# Altium schematic sheet turkin_ivt23_1d_list2.SchDoc
size 420 x 297 mm; SheetNumber: 2; SheetTotal: 2
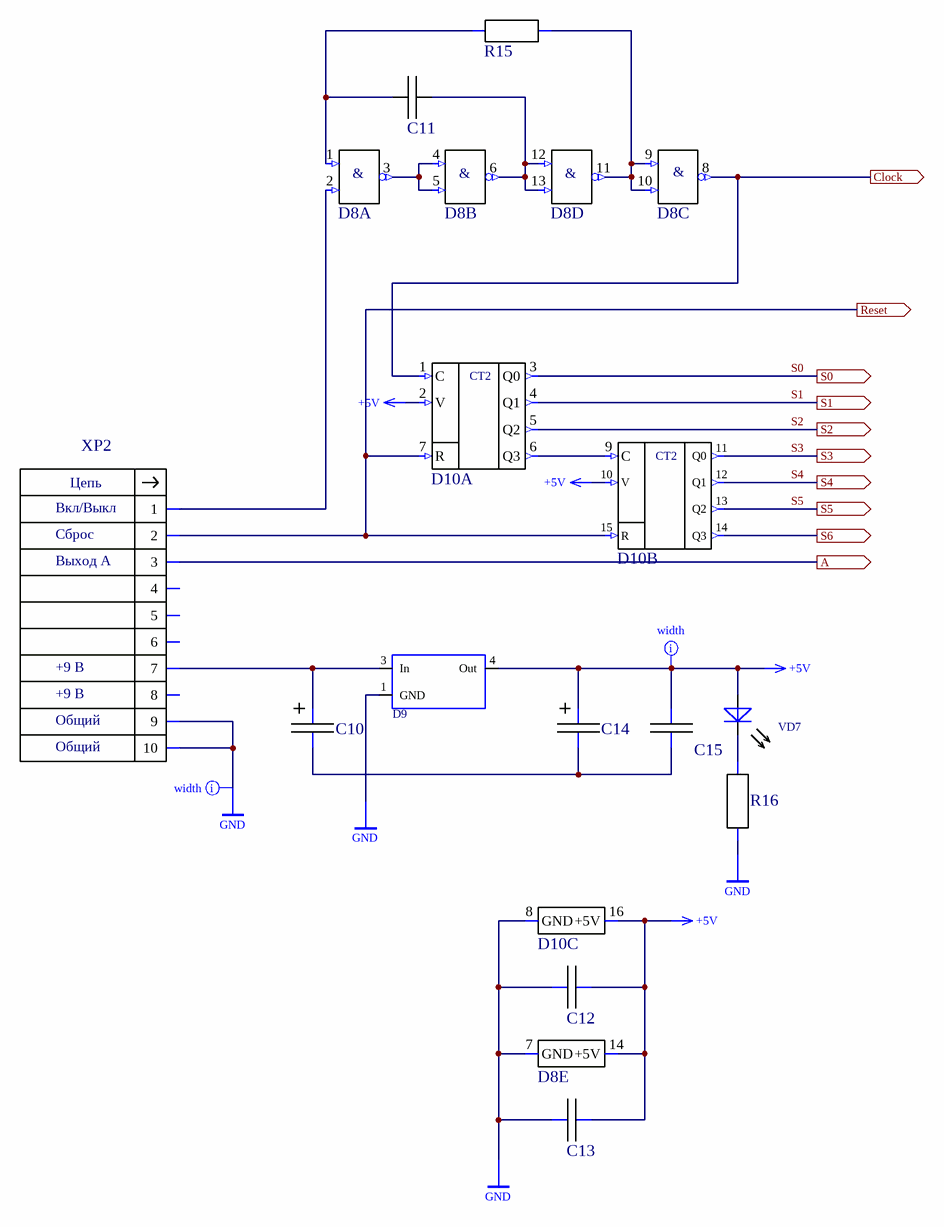
[diagram p0: turkin_ivt23_1d_list2.SchDoc]

## Parts
C10  C  [C-Tantal]  (value not drawn)
C11  1210  [K10-79_3.2_2.5(1210)]  (value not drawn)
C12  (no value)  [0805_N]
C13  (no value)  [0805_N]
C14  C  [C-Tantal]  (value not drawn)
C15  (no value)  [0805_N]
D8  74AC00SC  [SO14-N]  (value not drawn)  (parts A,B,C,D,E of 5)
D9  LM1117DTX-5.0/NOPB  [TO-252]  (value not drawn)
D10  (no value)  [DIP16]  (parts A,B,C of 3)
R15  (no value)  [RES_0603_1608_N]
R16  0805  [RES_0805_2012_N]  (value not drawn)
VD7  521-9466  [521-9466]  (value not drawn)
XP2  TE_1-1634689-0  [BH-10R]  (value not drawn)

## Ports
A (out), Clock (out), Reset (out), S0 (out), S1 (out), S2 (out), S3 (out), S4 (out), S5 (out), S6 (out)

## Nets
+5V: C12.2 C13.2 C14.+ C15.1 D8.14(+5V) D9.4(Out) D10.2(V) D10.10(V) D10.16(+5V) VD7.A
GND: C12.1 C13.1 D8.7(GND) D9.1(GND) D10.8(GND) R16.1 XP2.9 XP2.10
A: XP2.3 ; port A
Clock: D8.8(Out) D10.1(C) ; port Clock
Reset: D10.7(R) D10.15(R) XP2.2 ; port Reset
S0: D10.3(Q0) ; port S0
S1: D10.4(Q1) ; port S1
S2: D10.5(Q2) ; port S2
S3: D10.11(Q0) ; port S3
S4: D10.12(Q1) ; port S4
S5: D10.13(Q2) ; port S5
S6: D10.14(Q3) ; port S6
NetC10_+: C10.+ D9.3(In) XP2.7
NetC10_-: C10.- C14.- C15.2
NetC11_1: C11.1 D8.1(In1) R15.1
NetC11_2: C11.2 D8.6(Out) D8.12(In1) D8.13(In2)
NetD8_2: D8.2(In2) XP2.1
NetD8_3: D8.3(Out) D8.4(In1) D8.5(In2)
NetD8_9: D8.9(In1) D8.10(In2) D8.11(Out) R15.2
NetD10_6: D10.6(Q3) D10.9(C)
NetR16_2: R16.2 VD7.C

Not connected (* = marked no-connect by the designer): XP2 4 5 6 8

## Layout directives
mark named width: +5V, GND

## Notes on the sheet
- Сброс
- (near XP2) Вкл/Выкл
- Выход А
- +9 В
- Общий
- Подп. дата
- Инв. № дубл.
- Взам. инв. №
- Подп. и дата
- Инв. № подл.
- Изм.
- Лист
- № докум.
- Подп.
- Дата
- ALTIUM GOSTBOM2.0 KEV
- Файл:
- Копировал
- Формат А3
- (in symbol 74AC00SC, part A) &
- (in symbol 74AC00SC, part B) &
- (in symbol 74AC00SC, part C) &
- (in symbol 74AC00SC, part D) &
- (in symbol MC14520BCP, part A) CT2
- (in symbol MC14520BCP, part B) CT2
- (in symbol TE_1-1634689-0) Цепь

## Library data of the parts
C10 C14 = K53-65_C_10%: К53-65 Конденсатор танталовый C(6032) 0,47-100 мкФ; Manufacturer: ОАО "Элеконд"; Value: 10мкФ; Voltage: 16В; TU: АЖЯР.673546.004 ТУ; Tolerance: 10%; Created_by: Желобаев; BOM: К53-65 "C" - 16ВB - 10мкФмкФ ±10% АЖЯР.673546.004 ТУ; Name2: Конденсатор К53-65; Weight: 0,3; Version: 0; Issue_date: 6.01.2019; Size: C; Name: К53-65; Case: C
C11 = К10-79_1210_Н30: Чип конденсатор 1210 Н30 ряд Е6; Manufacturer: ООО "Кулон"; Name: Конденсатор К10-79; Reliability: 0.000005; Permit MPSU: разрешен; LiveStatus: производится; Packing: катушка; LibraryEngeneer: Желобаев; Tolerance: ±20%; Datum: 19_12_2018; TU: АЖЯР.673511.004 ТУ; Type: K10-79; Hight: 1.75; Voltage: 10В; Value_KD: 0.22мкФ; BOM: Конденсатор К10-79-10В-B-0.22мкФ±20%-Н30 АЖЯР.673511.004 ТУ; Version: 00; HelpURL: \\papa\Info\Altium_Library\Даташиты_и_ТУ\Конденсаторы_отечественные\К10-79_АЖЯР_673511_004ТУ.pdf; Weight: 0.2; TKE: Н30; Size: 1210; Value: *
C12 C13 C15 = К10-79_0805_Н90: Чип конденсатор 0805 Н90 ряд Е6; Manufacturer: ООО "Кулон"; Name: К10-79; Tolerance: +80%-20%; TU: АЖЯР.673511.004 ТУ; Type: K10-79; Voltage: 25В; Value: 0.1мкФ; BOM: К10-79-25В-B-*+80%-20%-Н90 АЖЯР.673511.004 ТУ; Created_by: Желобаев; Name2: Конденсатор К10-79; Version: 0; Weight: 0.05; TKE: Н90; Value_KD: *; Case: 0805; Issue_date: 19_12_2018
D8 = 74AC00SC: 4 элемента 2И-НЕ TTL SOIC-14; Manufacturer: ON Semiconductor; BOM: 74AC00SC "ON Semiconductor"; Created_by: Желобаев; Power_Voltage: 4.5 - 5.5 V; Name2: Микросхема 74AC00SC; Issue_date: 10.04.2019; Case: SOIC-14; Version: 0; Name: 74AC00SC
D10 = MC14520BCP: Два двоичных счетчика; Manufacturer: Motorola; Created_by: Желобаев; BOM: MC14520BCP "Motorola"; Name2: Микросхема MC14520BCP; Issue_date: 6.01.2019; Version: 0; Name: MC14520BCP; Case: DIP-16
R15 = Р1-12-0,1-5%: Резистор от 0,75 Ом до 10 МОм; Manufacturer: ОАО "НПО "Эркон"; Tolerance: 5%; TU: АЛЯР.434110.005 ТУ; Voltage: 50; TKR: M; BOM: Р1-12-0,1 * 5%-M-"A" АЛЯР.434110.005 ТУ; Value: 5.1КОм; Created_by: Желобаев; Name2: Резистор Р1-12-0,1; Version: 00; Type: Р1-12-0,1±5%-М-"А"; Weight: 0,005; Size: 0603; Name: Р1-12-0,1; Value_KD: *; Issue_date: 10.04.2019; Case: 0603
R16 = Р1-12-0,125-5%: Резистор от 0,75 Ом до 2 МОм; Manufacturer: ОАО "НПО "Эркон"; Tolerance: 5%; Created_by: Желобаев; TU: АЛЯР.434110.005 ТУ; Voltage: 150; TKR: M; BOM: Р1-12-0,125 * 5%-M-"A" АЛЯР.434110.005 ТУ; Value: 270Ом; Name2: Резистор Р1-12-0,125; Issue_Date: 05_12_2018; Version: 00; Type: Р1-12-0,125±5%-М-"А"; Weight: 0,01; Size: 0805; Name: Р1-12-0,125; Value_KD: *; Case: 0805
VD7 = 521-9466: Светодиод 5мм желтый; BOM: 521-9466 Dialight
XP2 = TE_1-1634689-0: Вилка типа BH-10R угловая правая двухрядная 2х5х2.54; Manufacturer: TE Connectivity; Created_by: Желобаев; BOM: TE_1-1634689-0 "TE Connectivity"; Name2: Вилка угловая TE_1-1634689-0; Name: TE_1-1634689-0; Issue_date: 13.05.2019; Version: 0; Case: BH-10R